# EAGLE design ArduinoNorShield (EAGLE 6.6.0)
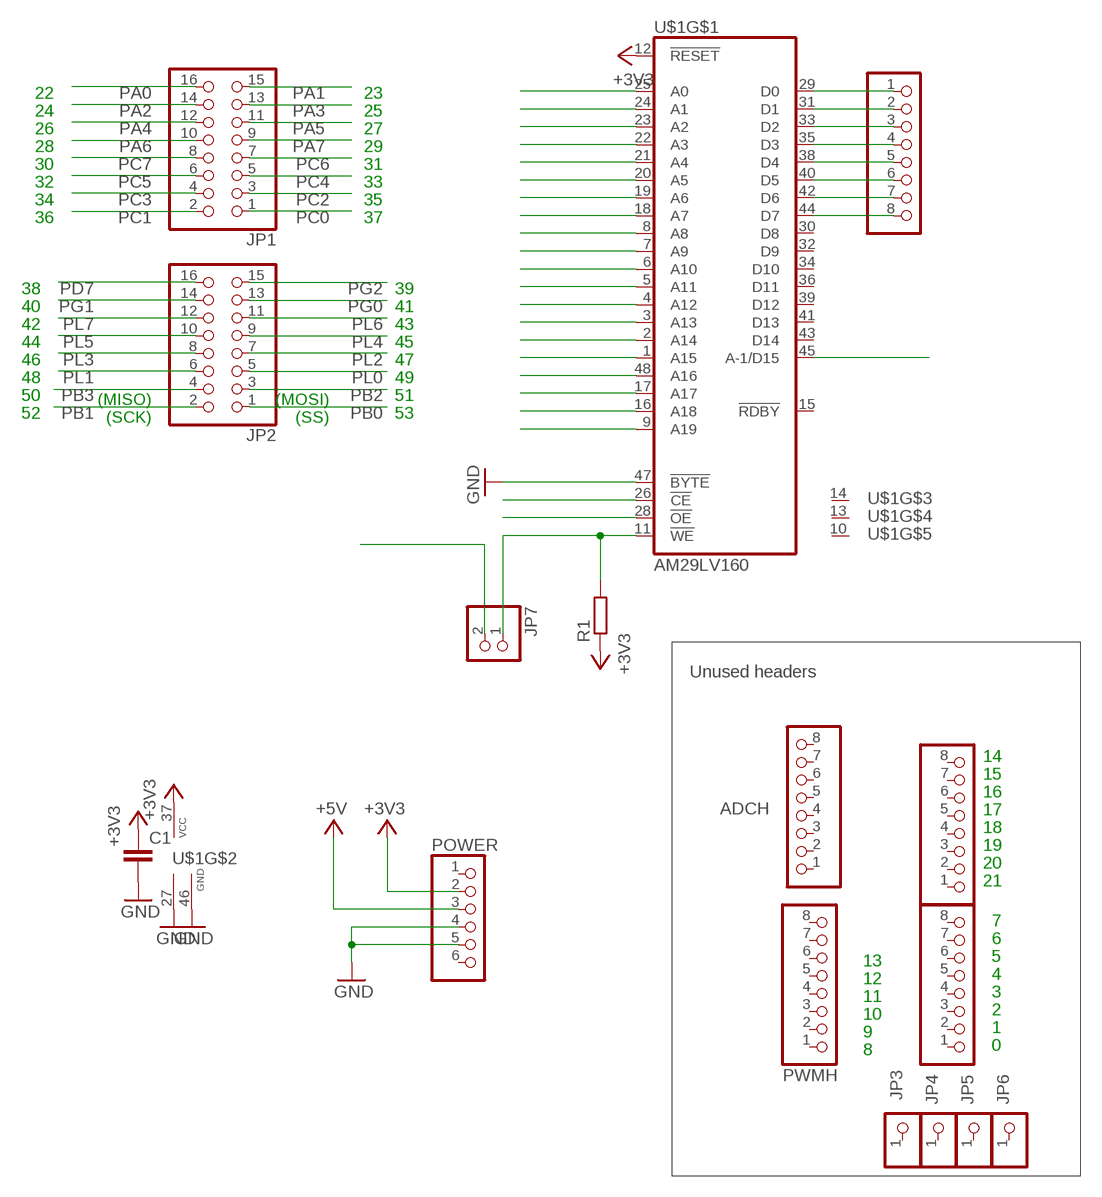
[diagram p0: schematic, sheet 1]

## Parts
ADCH  PINHD-1X8  [1X08]
ADCL  PINHD-1X8  [1X08]
C1  C-EUC0805  [C0805]
COMMUNICATION  PINHD-1X8  [1X08]
JP1  PINHD-2X8  [2X08]
JP2  PINHD-2X8  [2X08]
JP3  PINHD-1X1  [1X01]
JP4  PINHD-1X1  [1X01]
JP5  PINHD-1X1  [1X01]
JP6  PINHD-1X1  [1X01]
JP7  PINHD-1X2  [1X02]
POWER  PINHD-1X6  [1X06]
PWMH  PINHD-1X8  [1X08]
PWML  PINHD-1X8  [1X08]
R1  R-EU_R0805  [R0805]
U$1  AM29LV160  [TSOP48]

## Nets
+3V3 [power]: C1.1 POWER.2 R1.1 U$1.12(!RESET) U$1.37(VCC)
+5V [usbvcc]: POWER.3
GND [gnd]: C1.2 POWER.4 POWER.5 U$1.27(GND) U$1.46(GND) U$1.47(!BYTE)
N$1: ADCL.1 U$1.29(D0)
N$2: ADCL.2 U$1.31(D1)
N$3: ADCL.3 U$1.33(D2)
N$4: ADCL.4 U$1.35(D3)
N$5: ADCL.5 U$1.38(D4)
N$6: ADCL.6 U$1.40(D5)
N$7: ADCL.7 U$1.42(D6)
N$8: ADCL.8 U$1.44(D7)
N$9: JP7.1 R1.2 U$1.11(!WE)
PA0: JP1.16 U$1.45(A-1/D15)
PA1: JP1.15 U$1.25(A0)
PA2: JP1.14 U$1.24(A1)
PA3: JP1.13 U$1.23(A2)
PA4: JP1.12 U$1.22(A3)
PA5: JP1.11 U$1.21(A4)
PA6: JP1.10 U$1.20(A5)
PA7: JP1.9 U$1.19(A6)
PB0: JP2.1
PB1: JP2.2
PB2: JP2.3
PB3: JP2.4
PC0: JP1.1 U$1.2(A14)
PC1: JP1.2 U$1.3(A13)
PC2: JP1.3 U$1.4(A12)
PC3: JP1.4 U$1.5(A11)
PC4: JP1.5 U$1.6(A10)
PC5: JP1.6 U$1.7(A9)
PC6: JP1.7 U$1.8(A8)
PC7: JP1.8 U$1.18(A7)
PD7: JP2.16 U$1.1(A15)
PG0: JP2.13 U$1.16(A18)
PG1: JP2.14 U$1.17(A17)
PG2: JP2.15 U$1.48(A16)
PL0: JP2.5
PL1: JP2.6
PL2: JP2.7
PL3: JP2.8
PL4: JP2.9 U$1.28(!OE)
PL5: JP2.10 U$1.26(!CE)
PL6: JP2.11 JP7.2
PL7: JP2.12 U$1.9(A19)
Unconnected: ADCH.1 ADCH.2 ADCH.3 ADCH.4 ADCH.5 ADCH.6 ADCH.7 ADCH.8 COMMUNICATION.1 COMMUNICATION.2 COMMUNICATION.3 COMMUNICATION.4 COMMUNICATION.5 COMMUNICATION.6 COMMUNICATION.7 COMMUNICATION.8 JP3.1 JP4.1 JP5.1 JP6.1 POWER.1 POWER.6 PWMH.1 PWMH.2 PWMH.3 PWMH.4 PWMH.5 PWMH.6 PWMH.7 PWMH.8 PWML.1 PWML.2 PWML.3 PWML.4 PWML.5 PWML.6 PWML.7 PWML.8 U$1.10(NC) U$1.13(NC) U$1.14(NC) U$1.15(!RDBY) U$1.30(D8) U$1.32(D9) U$1.34(D10) U$1.36(D11) U$1.39(D12) U$1.41(D13) U$1.43(D14)

## Notes on the sheet
- 22 | 23
- 24 | 25
- 26 | 27
- 28 | 29
- 30 | 31
- 32 | 33
- 34 | 35
- 36 | 37
- 38 | 39
- 40 | 41
- 42 | 43
- 44 | 45
- 46 | 47
- 48 | 49
- 50 | (MISO) | (MOSI) | 51
- 52 | (SCK) | (SS) | 53
- Unused headers
- 14
- 15
- 16
- 17
- 18
- 19
- 20
- 21
- 7
- 6
- 13 | 5
- 12 | 4
- 11 | 3
- 10 | 2
- 9 | 1
- 8 | 0

## Library data of the parts
ADCH ADCL COMMUNICATION PWMH PWML = pinhead:PINHD-1X8: PIN HEADER
C1 = rcl:C-EU: CAPACITOR, European symbol
JP1 JP2 = pinhead:PINHD-2X8: PIN HEADER
JP3-JP6 = pinhead:PINHD-1X1: PIN HEADER
JP7 = pinhead:PINHD-1X2: PIN HEADER
POWER = pinhead:PINHD-1X6: PIN HEADER
R1 = rcl:R-EU_: RESISTOR, European symbol
U$1 = am29-memory:AM29LV160

## Net classes
0 default: width 0.203 mm, drill 0.406 mm, clearance 0.203 mm
1 power: width 0.61 mm, drill 0.711 mm, clearance 0.203 mm
2 gnd: width 0.305 mm, drill 0.711 mm, clearance 0.203 mm
3 usbvcc: width 0.508 mm, drill 0.711 mm, clearance 0.203 mm

## Board
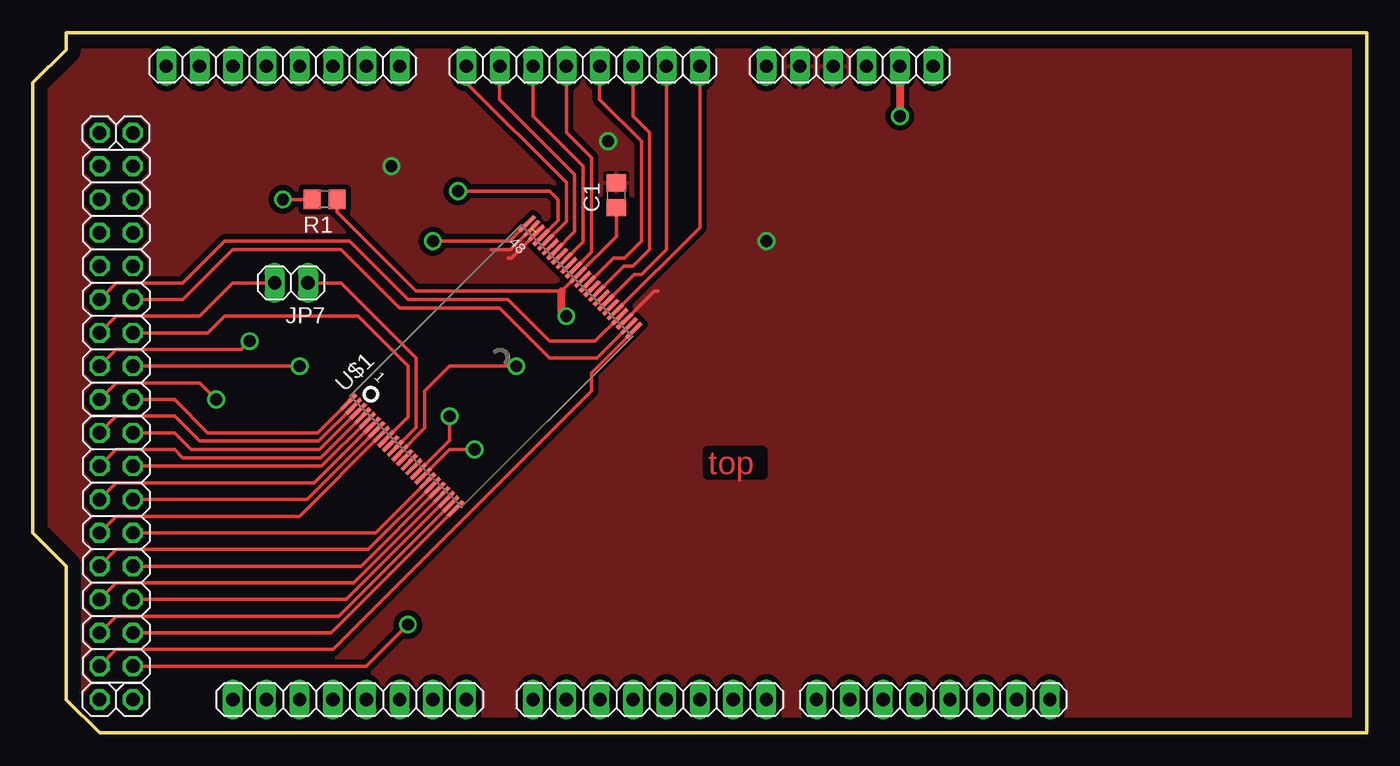
[diagram p1: board, top side]
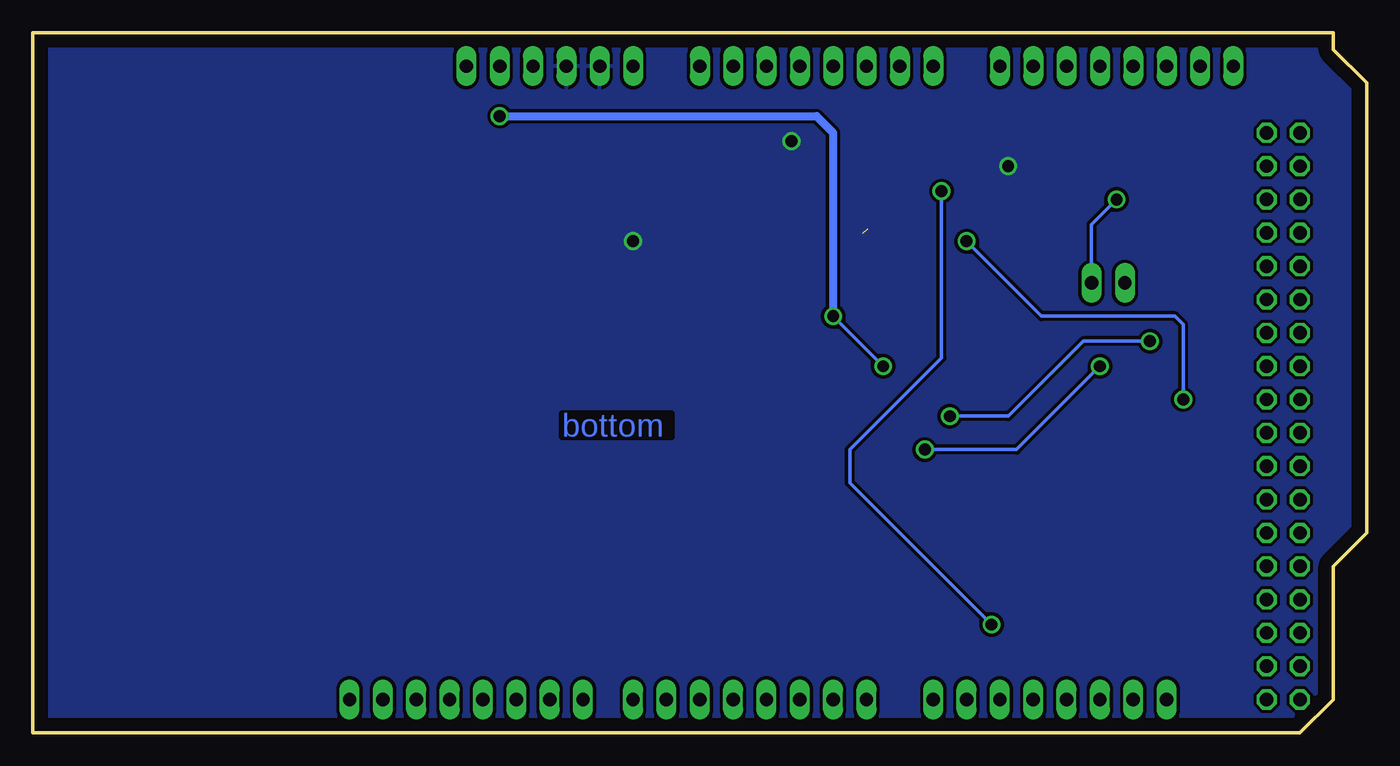
[diagram p2: board, bottom side, seen from below]

Size 101.6 x 53.34 mm. Coordinates in mm from the lower left corner, seen from the top.
Outline: 101.6,0 5.08,0 2.54,2.54 2.54,12.7 0,15.24 0,49.53 2.54,52.07 2.54,53.34 101.6,53.34 101.6,0
Copper layers (1*16): Top 0.035mm / dielectric 1.5mm / Bottom 0.035mm
Design rules "fablab_expert": minimum track width 8mil, minimum drill 0.8mm, track to track 7mil, track to pad 7mil, pad to pad 7mil, via to via 21mil, smd to smd 0mil, copper to edge 40mil, drill to drill 8mil, minimum pad ring 10mil, minimum via ring 8mil, stop-mask expansion 4mil, vias tented up to drill 0mil, thermal gap 10mil

### Footprints (pad centres in the part's own frame; a part is rotated, then mirrored left to right if it is on the bottom)
1X08 = drill 1.016 long: 1 -8.89,0; 2 -6.35,0; 3 -3.81,0; 4 -1.27,0; 5 1.27,0; 6 3.81,0; 7 6.35,0; 8 8.89,0
C0805 = smd 1.3 x 1.5: 1 -0.95,0; 2 0.95,0
2X08 = drill 1.016 octagon: 1 -8.89,-1.27; 2 -8.89,1.27; 3 -6.35,-1.27; 4 -6.35,1.27; 5 -3.81,-1.27; 6 -3.81,1.27; 7 -1.27,-1.27; 8 -1.27,1.27; 9 1.27,-1.27; 10 1.27,1.27; 11 3.81,-1.27; 12 3.81,1.27; 13 6.35,-1.27; 14 6.35,1.27; 15 8.89,-1.27; 16 8.89,1.27
1X01 = drill 1.016 octagon: 1 0,0
1X02 = drill 1.016 long: 1 -1.27,0; 2 1.27,0
1X06 = drill 1.016 long: 1 -6.35,0; 2 -3.81,0; 3 -1.27,0; 4 1.27,0; 5 3.81,0; 6 6.35,0
R0805 = smd 1.3 x 1.5: 1 -0.95,0; 2 0.95,0
TSOP48 = smd 0.3 x 1.6: 1 -5.75,-9.6; 2 -5.25,-9.6; 3 -4.75,-9.6; 4 -4.25,-9.6; 5 -3.75,-9.6; 6 -3.25,-9.6; 7 -2.75,-9.6; 8 -2.25,-9.6; 9 -1.75,-9.6; 10 -1.25,-9.6; 11 -0.75,-9.6; 12 -0.25,-9.6; 13 0.25,-9.6; 14 0.75,-9.6; 15 1.25,-9.6; 16 1.75,-9.6; 17 2.25,-9.6; 18 2.75,-9.6; 19 3.25,-9.6; 20 3.75,-9.6; 21 4.25,-9.6; 22 4.75,-9.6; 23 5.25,-9.6; 24 5.75,-9.6; 25 5.75,9.6; 26 5.25,9.6; 27 4.75,9.6; 28 4.25,9.6; 29 3.75,9.6; 30 3.25,9.6; 31 2.75,9.6; 32 2.25,9.6; 33 1.75,9.6; 34 1.25,9.6; 35 0.75,9.6; 36 0.25,9.6; 37 -0.25,9.6; 38 -0.75,9.6; 39 -1.25,9.6; 40 -1.75,9.6; 41 -2.25,9.6; 42 -2.75,9.6; 43 -3.25,9.6; 44 -3.75,9.6; 45 -4.25,9.6; 46 -4.75,9.6; 47 -5.25,9.6; 48 -5.75,9.6

### Placement (x,y rotation side)
ADCH  19.05,50.8 180 top
ADCL  41.91,50.8 180 top
C1  44.45,40.96 90 top
COMMUNICATION  24.13,2.54 0 top
JP1  6.35,13.97 270 top
JP2  6.35,34.29 270 top
JP3  7.62,2.54 180 top
JP4  5.08,2.54 180 top
JP5  7.62,45.72 180 top
JP6  5.08,45.72 180 top
JP7  19.69,34.29 180 top
POWER  62.23,50.8 180 top
PWMH  68.58,2.54 0 top
PWML  46.99,2.54 0 top
R1  22.23,40.64 180 top
U$1  34.92,27.94 315 top

### Tracks (layer width: path | path; a pad name or v marks a point on that pad's centre or on a via)
+3V3  (via drill 0.9 pad 1.2)
  Top 0.254: R1.1 23.18,39.69 29.21,33.65 40.29,33.65 U$1.37 44.45,37.82 C1.1 | U$1.12 29.85,23.21 29.85,26.03 31.75,27.94 v36.83,27.94
  Top 0.61: POWER.2 v66.04,46.99 | v40.64,31.75 40.29,32.1 40.29,33.65
  Bottom 0.254: v36.83,27.94 v40.64,31.75
  Bottom 0.61: v66.04,46.99 41.91,46.99 40.64,45.72 v40.64,31.75
GND  (via drill 0.9 pad 1.2)  (1 unrouted)
  Top 0.254: U$1.47 36.39,36.83 34.92,36.83 | U$1.46 36.46,36.2 36.2,36.2 | U$1.27 47.36,33.65 47.62,33.65
  other vias: 27.3,43.18 55.88,37.46 43.81,45.09
  pour Top (isolate 0.406, rank 2): 100.97,0.63 0,0.63 0,52.7 100.97,52.7
  pour Bottom (isolate 0.254, rank 2): 0,53.34 101.6,53.34 101.6,0 0,0
N$1
  Top 0.254: ADCL.1 50.8,38.51 U$1.29
N$2
  Top 0.254: U$1.31 45.8,34.92 46.36,34.92 48.26,36.83 ADCL.2
N$3
  Top 0.254: U$1.33 45.02,35.56 45.72,35.56 46.99,36.83 46.99,45.72 45.72,46.99 ADCL.3
N$4
  Top 0.254: U$1.35 44.24,36.2 45.09,36.2 46.36,37.46 46.36,45.09 43.18,48.26 ADCL.4
N$5
  Top 0.254: ADCL.5 40.64,45.72 42.55,43.81 42.55,36.62 U$1.38
N$6
  Top 0.254: ADCL.6 38.1,46.99 41.91,43.18 41.91,37.4 U$1.40
N$7
  Top 0.254: ADCL.7 35.56,48.26 41.27,42.54 41.27,38.18 U$1.42
N$8
  Top 0.254: ADCL.8 33.02,49.53 40.64,41.91 40.64,38.96 U$1.44
N$9  (via drill 0.9 pad 1.2)
  Top 0.254: JP7.1 23.5,34.29 29.21,28.57 29.21,23.29 U$1.11 | R1.2 v19.05,40.64
  Bottom 0.254: v19.05,40.64 20.96,38.73 JP7.1
PA0  (via drill 0.9 pad 1.2)
  Top 0.254: JP1.16 25.4,5.08 v28.58,8.25 | U$1.45 40.01,39.03 40.01,40.64 39.37,41.27 v32.39,41.27
  Bottom 0.254: v28.58,8.25 39.37,19.05 39.37,21.59 32.39,28.57 v32.39,41.27
PA1
  Top 0.254: JP1.15 6.35,6.35 22.86,6.35 42.55,26.03 42.55,27.43 U$1.25
PA2
  Top 0.254: JP1.14 20.96,7.62 22.03,7.62 22.74,7.62 U$1.24
PA3
  Top 0.254: JP1.13 6.35,8.89 22.23,8.89 22.59,8.89 23.3,8.89 U$1.23
PA4
  Top 0.254: JP1.12 23.86,10.16 U$1.22
PA5
  Top 0.254: JP1.11 6.35,11.43 24.43,11.43 U$1.21
PA6
  Top 0.254: JP1.10 24.99,12.7 U$1.20
PA7
  Top 0.254: JP1.9 6.35,13.97 24.13,13.97 24.84,13.97 25.55,13.97 U$1.19
PC0
  Top 0.254: JP1.1 6.35,24.13 10.8,24.13 12.7,22.22 21.79,22.22 U$1.2
PC1
  Top 0.254: U$1.3 21.86,21.59 12.06,21.59 10.8,22.86 JP1.2
PC2
  Top 0.254: JP1.3 6.35,21.59 10.8,21.59 11.43,20.95 21.93,20.95 U$1.4
PC3
  Top 0.254: JP1.4 22,20.32 U$1.5
PC4
  Top 0.254: JP1.5 6.35,19.05 21.44,19.05 U$1.6
PC5
  Top 0.254: JP1.6 20.88,17.78 U$1.7
PC6
  Top 0.254: JP1.7 6.35,16.51 20.31,16.51 U$1.8
PC7
  Top 0.254: JP1.8 26.11,15.24 U$1.18
PD7
  Top 0.254: U$1.1 21.71,22.86 13.34,22.86 10.8,25.4 JP2.16
PG0  (via drill 0.9 pad 1.2)
  Top 0.254: JP2.13 6.35,29.21 15.88,29.21 v16.51,29.84 | v31.75,24.13 31.75,22.29 U$1.16
  Bottom 0.254: v16.51,29.84 21.59,29.84 27.3,24.13 v31.75,24.13
PG1  (via drill 0.9 pad 1.2)
  Top 0.254: JP2.14 v20.32,27.94 | v33.66,21.59 31.74,21.59 U$1.17
  Bottom 0.254: v20.32,27.94 26.67,21.59 v33.66,21.59
PG2  (via drill 0.9 pad 1.2)
  Top 0.254: JP2.15 6.35,26.67 12.7,26.67 v13.97,25.4 | U$1.48 36.32,37.46 v30.48,37.46
  Bottom 0.254: v13.97,25.4 13.97,31.12 14.61,31.75 24.77,31.75 v30.48,37.46
PL4
  Top 0.254: JP2.9 6.35,34.29 11.43,34.29 14.61,37.46 24.13,37.46 28.58,33.02 36.2,33.02 39.37,29.84 42.84,29.84 U$1.28
PL5
  Top 0.254: JP2.10 11.43,33.02 15.24,36.83 23.5,36.83 27.94,32.38 35.56,32.38 39.37,28.57 42.98,28.57 U$1.26
PL6
  Top 0.254: JP2.11 6.35,31.75 12.7,31.75 15.24,34.29 JP7.2
PL7
  Top 0.254: U$1.9 28.58,24.06 28.58,27.94 24.77,31.75 14.61,31.75 13.34,30.48 JP2.12

### Text on the board
Top: top
Bottom: bottom